# Altium schematic sheet 0 overview.SchDoc
size A4; DocumentNumber: 0; SheetNumber: 2; SheetTotal: 12
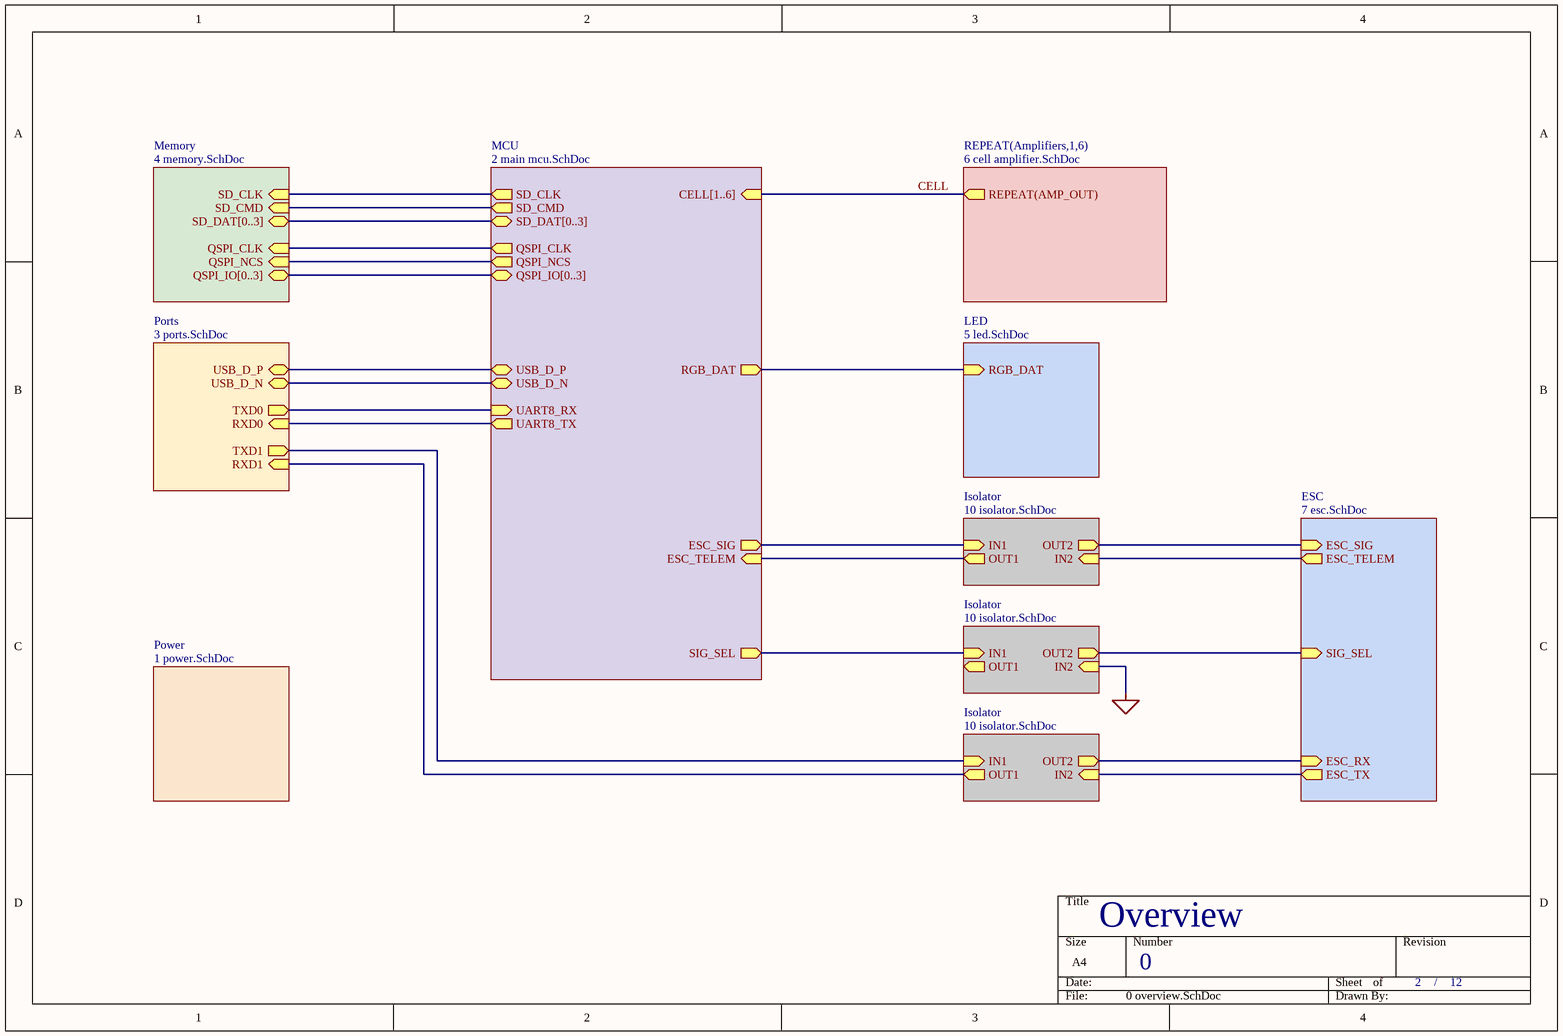
[diagram p0: 0 overview.SchDoc]

## Sub-sheets
ESC = 7 esc.SchDoc: ESC_TELEM (out), ESC_SIG (in), SIG_SEL (in), ESC_TX (out), ESC_RX (in)
Isolator = 10 isolator.SchDoc: OUT1 (out), IN1 (in), OUT2 (out), IN2 (in)
Isolator = 10 isolator.SchDoc: OUT1 (out), IN1 (in), OUT2 (out), IN2 (in)
Isolator = 10 isolator.SchDoc: OUT1 (out), IN1 (in), OUT2 (out), IN2 (in)
LED = 5 led.SchDoc: RGB_DAT (in)
MCU = 2 main mcu.SchDoc: USB_D_P (bidir), USB_D_N (bidir), ESC_SIG (out), SIG_SEL (out), ESC_TELEM (in), SD_CLK (out), SD_CMD (out), SD_DAT[0..3] (bidir), QSPI_IO[0..3] (bidir), QSPI_CLK (out), QSPI_NCS (out), RGB_DAT (out), CELL[1..6] (in), UART8_TX (out), UART8_RX (in)
Memory = 4 memory.SchDoc: SD_CLK (in), SD_CMD (in), SD_DAT[0..3] (bidir), QSPI_IO[0..3] (bidir), QSPI_CLK (in), QSPI_NCS (in)
Ports = 3 ports.SchDoc: USB_D_P (bidir), USB_D_N (bidir), RXD0 (in), TXD0 (out), TXD1 (out), RXD1 (in)
Power = 1 power.SchDoc: no entries
REPEAT(Amplifiers,1,6) = 6 cell amplifier.SchDoc: REPEAT(AMP_OUT) (out)

## Nets
PGND: sheet Isolator/IN2
CELL: sheet REPEAT(Amplifiers,1,6)/REPEAT(AMP_OUT)
(unnamed): sheet MCU/USB_D_P, sheet Ports/USB_D_P
(unnamed): sheet MCU/USB_D_N, sheet Ports/USB_D_N
(unnamed): sheet MCU/ESC_SIG, sheet Isolator/IN1
(unnamed): sheet MCU/SIG_SEL, sheet Isolator/IN1
(unnamed): sheet MCU/ESC_TELEM, sheet Isolator/OUT1
(unnamed): sheet MCU/SD_CLK, sheet Memory/SD_CLK
(unnamed): sheet MCU/SD_CMD, sheet Memory/SD_CMD
(unnamed): sheet MCU/QSPI_CLK, sheet Memory/QSPI_CLK
(unnamed): sheet MCU/QSPI_NCS, sheet Memory/QSPI_NCS
(unnamed): sheet MCU/RGB_DAT, sheet LED/RGB_DAT
(unnamed): sheet MCU/UART8_TX, sheet Ports/RXD0
(unnamed): sheet MCU/UART8_RX, sheet Ports/TXD0
(unnamed): sheet Ports/TXD1, sheet Isolator/IN1
(unnamed): sheet Ports/RXD1, sheet Isolator/OUT1
(unnamed): sheet ESC/ESC_TELEM, sheet Isolator/IN2
(unnamed): sheet ESC/ESC_SIG, sheet Isolator/OUT2
(unnamed): sheet ESC/SIG_SEL, sheet Isolator/OUT2
(unnamed): sheet ESC/ESC_TX, sheet Isolator/IN2
(unnamed): sheet ESC/ESC_RX, sheet Isolator/OUT2

## Buses and harness runs
bus sheet MCU/QSPI_IO[0..3] = sheet Memory/QSPI_IO[0..3]
bus sheet MCU/SD_DAT[0..3] = sheet Memory/SD_DAT[0..3]

## Notes on the sheet
- Overview
- /